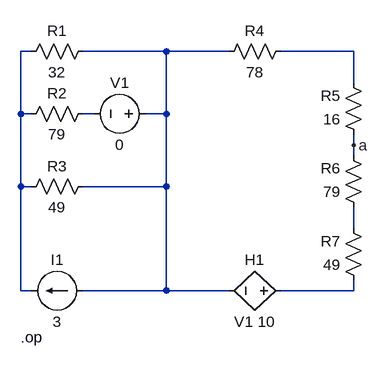
[diagram p0: schematic E1.asc]
E1.asc, the LTspice schematic file:
Version 4.1
SHEET 1 880 680
WIRE -32 32 -48 32
WIRE 176 32 48 32
WIRE 272 32 176 32
WIRE 464 32 352 32
WIRE 464 80 464 32
WIRE -48 128 -48 32
WIRE -32 128 -48 128
WIRE 64 128 48 128
WIRE 176 128 176 32
WIRE 176 128 144 128
WIRE 464 176 464 160
WIRE 464 192 464 176
WIRE -48 240 -48 128
WIRE -32 240 -48 240
WIRE 176 240 176 128
WIRE 176 240 48 240
WIRE 464 304 464 272
WIRE -48 400 -48 240
WIRE -32 400 -48 400
WIRE 176 400 176 240
WIRE 176 400 48 400
WIRE 272 400 176 400
WIRE 464 400 464 384
WIRE 464 400 352 400
FLAG 464 176 a
SYMBOL res 64 16 R90
WINDOW 0 0 56 VBottom 2
WINDOW 3 32 56 VTop 2
SYMATTR InstName R1
SYMATTR Value 32
SYMBOL res 64 112 R90
WINDOW 0 0 56 VBottom 2
WINDOW 3 32 56 VTop 2
SYMATTR InstName R2
SYMATTR Value 79
SYMBOL res 64 224 R90
WINDOW 0 0 56 VBottom 2
WINDOW 3 32 56 VTop 2
SYMATTR InstName R3
SYMATTR Value 49
SYMBOL res 368 16 R90
WINDOW 0 0 56 VBottom 2
WINDOW 3 32 56 VTop 2
SYMATTR InstName R4
SYMATTR Value 78
SYMBOL res 480 176 R180
WINDOW 0 36 76 Left 2
WINDOW 3 36 40 Left 2
SYMATTR InstName R5
SYMATTR Value 16
SYMBOL res 480 288 R180
WINDOW 0 36 76 Left 2
WINDOW 3 36 40 Left 2
SYMATTR InstName R6
SYMATTR Value 79
SYMBOL res 480 400 R180
WINDOW 0 36 76 Left 2
WINDOW 3 36 40 Left 2
SYMATTR InstName R7
SYMATTR Value 49
SYMBOL current 48 400 R90
WINDOW 0 -32 40 VBottom 2
WINDOW 3 32 40 VTop 2
WINDOW 123 0 0 Left 0
WINDOW 39 0 0 Left 0
SYMATTR InstName I1
SYMATTR Value 3
SYMBOL h 368 400 R90
WINDOW 0 -32 56 VBottom 2
WINDOW 3 32 56 VTop 2
SYMATTR InstName H1
SYMATTR Value V1 10
SYMBOL voltage 160 128 R90
WINDOW 0 -32 56 VBottom 2
WINDOW 3 32 56 VTop 2
WINDOW 123 0 0 Left 0
WINDOW 39 0 0 Left 0
SYMATTR InstName V1
SYMATTR Value 0
TEXT -48 472 Left 2 !.op

The netlist it stands for:
* E1.asc
R1 N002 N001 32
R2 N004 N001 79
R3 N002 N001 49
R4 N003 N002 78
R5 a N003 16
R6 N005 a 79
R7 N006 N005 49
I1 N002 N001 3
H1 N006 N002 V1 10
V1 N002 N004 0
.op
.backanno
.end